# Altium schematic sheet CAN Bus.SchDoc
size A; SheetNumber: 2; SheetTotal: 9
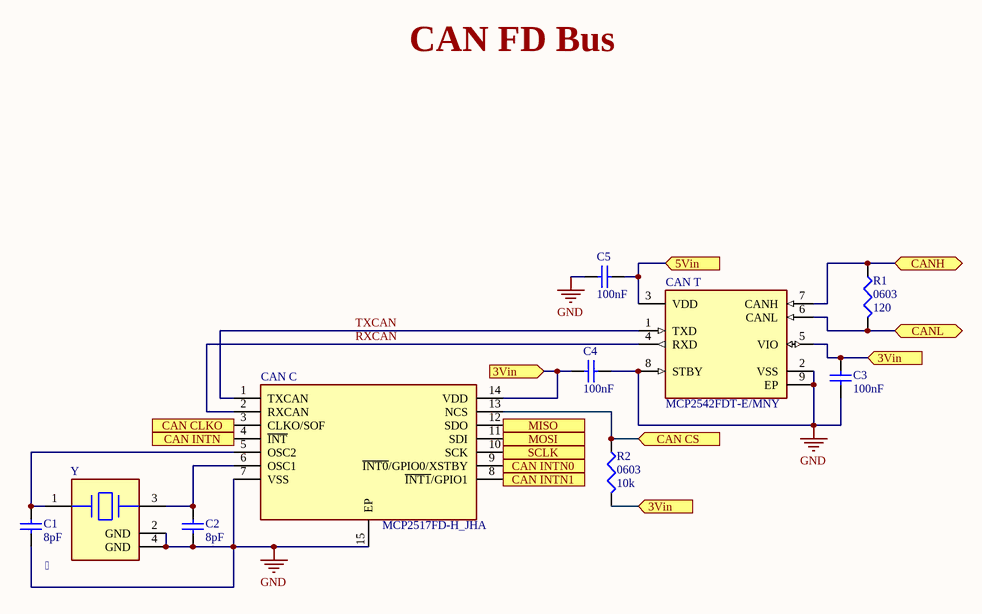
[diagram p0: CAN Bus.SchDoc]

## Parts
C1  8pF  [CAPC1608X95X40ML15T15]
C2  8pF  [CAPC1608X95X40ML15T15]
C3  100nF  [CAPC1608X95X40ML15T15]
C4  100nF  [CAPC1608X95X40ML15T15]
C5  100nF  [CAPC1608X95X40ML15T15]
CAN_C  MCP2517FD-H_JHA  [SON65P300X450X90-15N-D]
CAN_T  MCP2542FDT-E/MNY  [FP-C04-129-MNY-MFG]
R1  0603  value 120  [J1-0603]
R2  0603  value 10k  [J1-0603]
Y    [FP-CX2016DB-MFG]

## Ports
3Vin (in), 5Vin (in), CAN CLKO (out), CAN CS (in), CAN INTN0 (out), CAN INTN1 (out), CAN INTN (out), CANH (bidir), CANL (bidir), MISO (out), MOSI (in), SCLK (in)

## Nets
GND: C1.1 C2.1 C3.1 C4.1 C5.1 CAN_C.7(VSS) CAN_C.15(EP) CAN_T.2(VSS) CAN_T.8(STBY) CAN_T.9(EP) Y.2(GND) Y.4(GND)
3Vin: C3.2 C4.2 CAN_C.14(VDD) CAN_T.5(VIO) R2.2 ; port 3Vin
5Vin: C5.2 CAN_T.3(VDD) ; port 5Vin
CAN CLKO: CAN_C.3(CLKO/SOF) ; port CAN CLKO
CAN CS: CAN_C.13(NCS) R2.1 ; port CAN CS
CAN INTN: CAN_C.4(~{INT}) ; port CAN INTN
CAN INTN0: CAN_C.9(~{INT0}/GPIO0/XSTBY) ; port CAN INTN0
CAN INTN1: CAN_C.8(~{INT1}/GPIO1) ; port CAN INTN1
CANH: CAN_T.7(CANH) R1.1 ; port CANH
CANL: CAN_T.6(CANL) R1.2 ; port CANL
MISO: CAN_C.12(SDO) ; port MISO
MOSI: CAN_C.11(SDI) ; port MOSI
RXCAN: CAN_C.2(RXCAN) CAN_T.4(RXD)
SCLK: CAN_C.10(SCK) ; port SCLK
TXCAN: CAN_C.1(TXCAN) CAN_T.1(TXD)
NetC1_2: C1.2 CAN_C.5(OSC2) Y.1
NetC2_2: C2.2 CAN_C.6(OSC1) Y.3

## Notes on the sheet
- CAN FD Bus

## Library data of the parts
C1-C5 = CMP-2006-01550-1: Manufacturer: Vitramon; Part Number: VJ0603Y104KXQCW1BC
CAN_C = MCP2517FD-H_JHA: Integrated Circuit; Manufacturer_Name: Microchip; Manufacturer_Part_Number: MCP2517FD-H/JHA; Datasheet Link: http://ww1.microchip.com/downloads/en/DeviceDoc/MCP2517FD-External-CAN-FD-Controller-with-SPI-Interface-20005688B.pdf; Height: 0.9mm; Mouser Part Number: 579-MCP2517FD-H/JHA; Mouser Price/Stock: https://www.mouser.co.uk/ProductDetail/Microchip-Technology/MCP2517FD-H-JHA?qs=HXFqYaX1Q2zUpFu1TRdQJQ%3D%3D; Arrow Part Number: MCP2517FD-H/JHA; Arrow Price/Stock: https://www.arrow.com/en/products/mcp2517fd-hjha/microchip-technology?region=nac
CAN_T = CMP-06279-000021-1: IC TRANSCEIVER 1/1 8TDFN; Data Rate: 8Mbps; Receiver Hysteresis: 200mV; Mount: Surface Mount; RoHS Compliant: Yes; Max Operating Temperature: 125°C; Min Operating Temperature: -40°C; Packaging: Tape and Reel
R1 R2 = Res3: Resistor; Published: 8-Jun-2000; LatestRevisionDate: 29-May-2009; LatestRevisionNote: IPC-7351 Footprint Added.; PackageReference: J1-0603; Publisher: Altium Limited; PackageDescription: Chip Resistor
Y = CMP-20727-000002-1: CRYSTAL 40.0000MHZ 8PF SMD; Manufacturer Part Number: CX2016DB40000D0FLJCC; Manufacturer: Kyocera International Inc. Electronic Components; Esr: 50Ω; Tolerance: 15ppm; Frequency: 40MHz; Series: CX2016DB; RoHS: TRUE; Temperature Range High: +85°C; Height: 0.45mm; ComponentLink2Description: Datasheet; Load Capacitance: 8pF; ComponentLink2URL: https://global.kyocera.com/prdct/electro/product/pdf/cx2016db_e.pdf; Temperature: -30°C to +85°C; Device Class L2: Crystals / Oscillators; Category: Crys; Mouser Description: Crystal 40MHz 8pF 4-Pin SMD T/R; Lead Free: Yes; Device Class L3: Crystals; Temperature Range Low: -30°C; Octopart: https://octopart.com/cx2016db40000d0fljcc-avx+%2F+kyocera-71139660; Device Class L1: Passive Components; Automotive: No; Digikey Description: CRYSTAL 40.0000MHZ 8PF SMD; Package: CX2016DB; Stability: 15ppm